# EAGLE design attinier84-motherboard-pth-mk-1.0 (EAGLE 6.5.0)
REVISION: 3.0
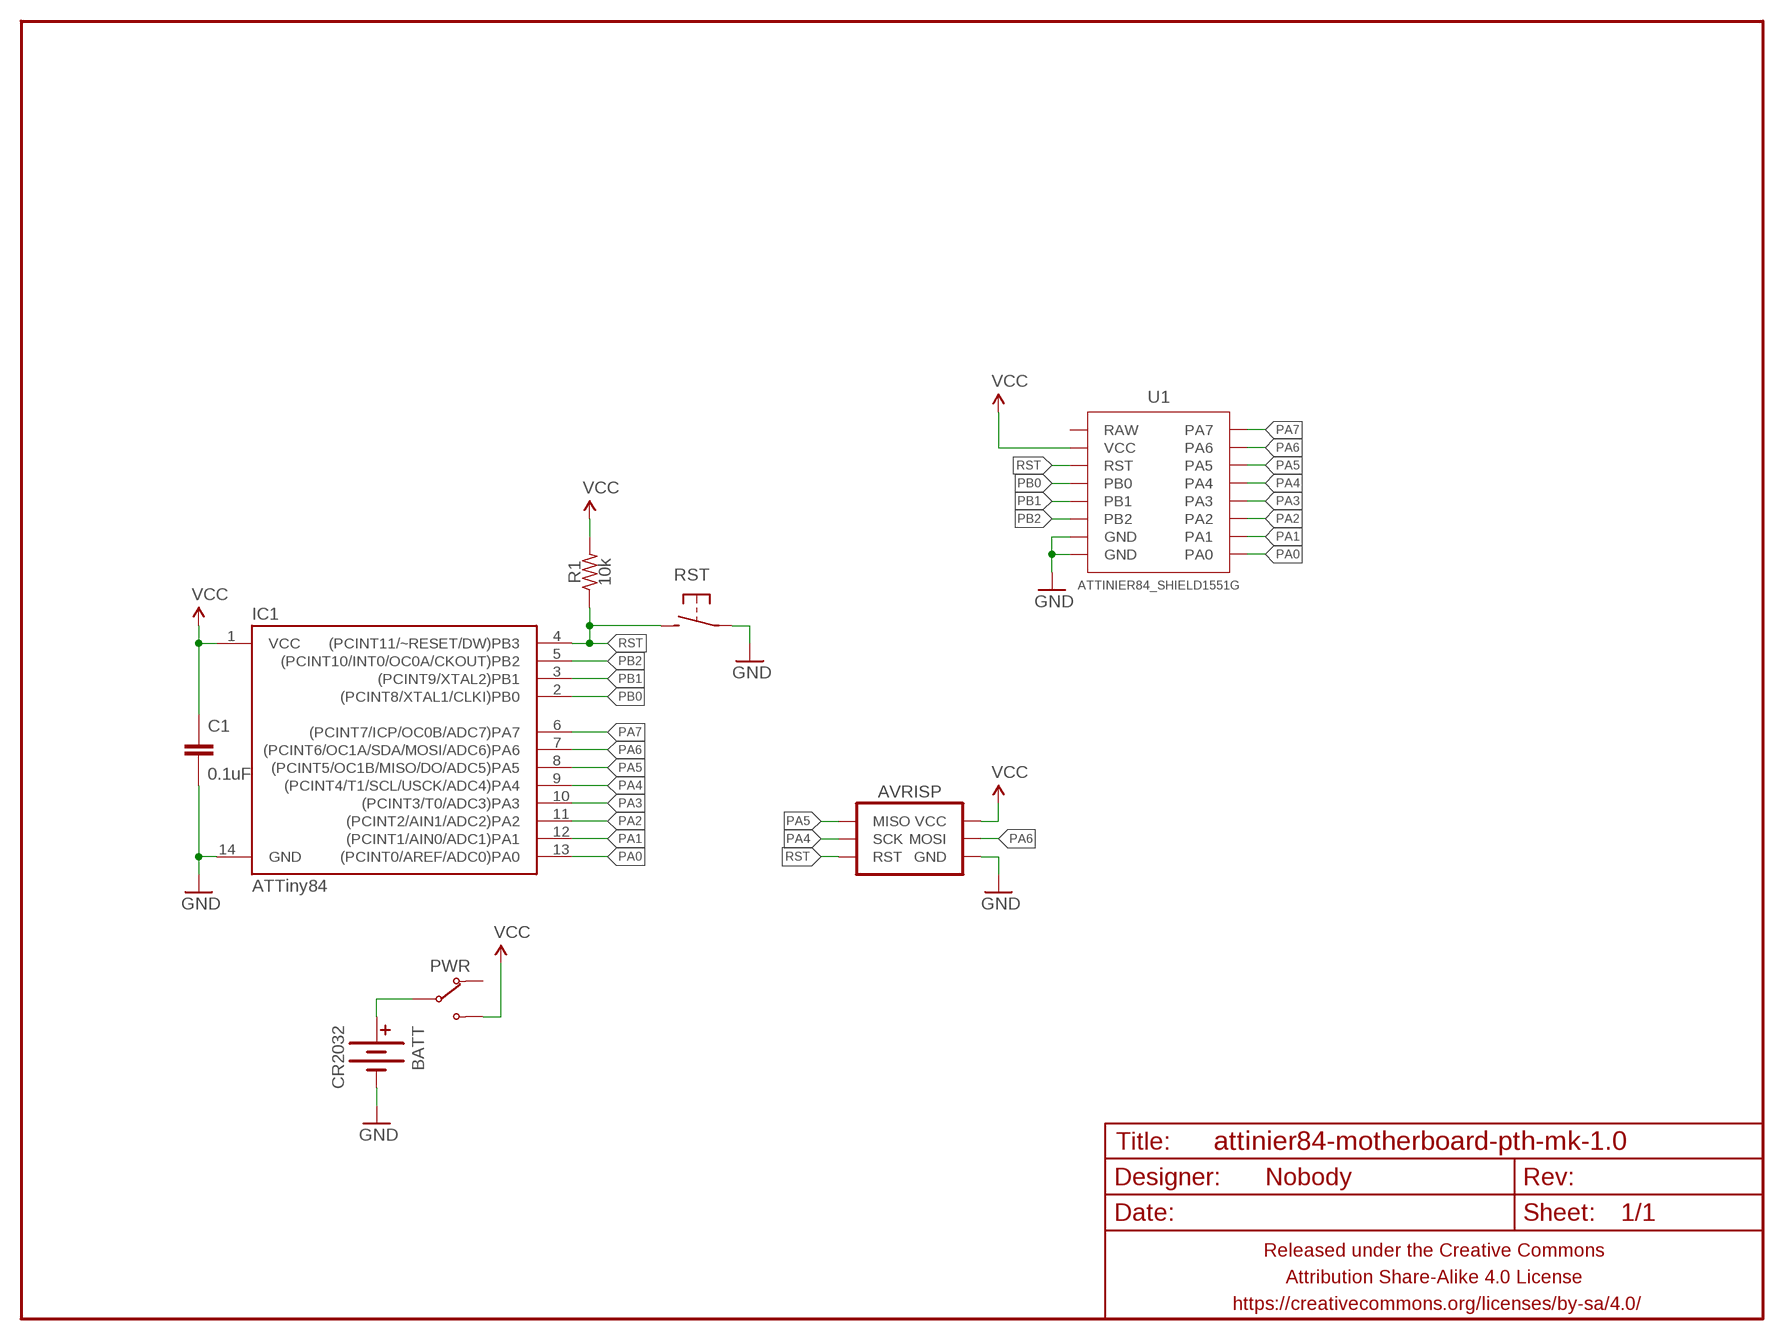
[diagram p0: schematic, sheet 1]

## Parts
AVRISP  AVR_SPI_PRG_6PTH  [2X3]
BATT  CR2032  BATTERY20PTH_TOPLOAD  [BATTCON_20MM_PTH_TOPLOAD]
C1  0.1uF  CAPACITOR-CERAMIC025-024X044  [C025-024X044]
FRAME1  FRAME-LETTERNO_PACKAGE  [DUMMY]
IC1  ATTiny84  ATTINY84ATTINY84-20PU  [DIL14]
PWR  SWITCH-SPDTPTH-RA-2.54MM  [SPDT-RA-2.54MM]
R1  10k  RESISTORPTH-AXIAL-7.62MM  [RESISTOR-AXIAL-PTH-7.62MM]
RST  SPST-NO-TACT3MM-RA  [TACTILE-PTH-SIDE]
U1  ATTINIER84_SHIELD1551G  [ATTINIER84_SHIELD2]

## Nets
GND: AVRISP.6(GND) BATT.- C1.2 IC1.14(GND) RST.1 U1.GND@1(GND) U1.GND@2(GND)
N$1: BATT.+ PWR.2(COM)
PA0: IC1.13((PCINT0/AREF/ADC0)PA0) U1.PA0
PA1: IC1.12((PCINT1/AIN0/ADC1)PA1) U1.PA1
PA2: IC1.11((PCINT2/AIN1/ADC2)PA2) U1.PA2
PA3: IC1.10((PCINT3/T0/ADC3)PA3) U1.PA3
PA4: AVRISP.3(SCK) IC1.9((PCINT4/T1/SCL/USCK/ADC4)PA4) U1.PA4
PA5: AVRISP.1(MISO) IC1.8((PCINT5/OC1B/MISO/DO/ADC5)PA5) U1.PA5
PA6: AVRISP.4(MOSI) IC1.7((PCINT6/OC1A/SDA/MOSI/ADC6)PA6) U1.PA6
PA7: IC1.6((PCINT7/ICP/OC0B/ADC7)PA7) U1.PA7
PB0: IC1.2((PCINT8/XTAL1/CLKI)PB0) U1.PB0
PB1: IC1.3((PCINT9/XTAL2)PB1) U1.PB1
PB2: IC1.5((PCINT10/INT0/OC0A/CKOUT)PB2) U1.PB2
RST: AVRISP.5(RST) IC1.4((PCINT11/~RESET/DW)PB3) R1.P$1 RST.2 U1.RST
VCC: AVRISP.2(VCC) C1.1 IC1.1(VCC) PWR.3(NO) R1.P$2 U1.VCC
Unconnected: PWR.1(NC) U1.RAW

## Library data of the parts
AVRISP = A_butts:AVR_SPI_PRG_6: AVR ISP 6 Pin This is the reduced ISP connector for AVR programming. Common on Arduino. This footprint will take up less PCB space and can be used with a 10-pin to 6-pin adapter such as SKU: BOB-08508 **Special note about "TEST_POINT" package. The stop mask is on the top side, so if you want your programming test points to be on the bottom of your board, make sure to place this package on the bottom side of the board. This also ensure that the orientation to program from the bottom side will be correct.
BATT = A_butts:BATTERY: Battery Holders Various common sizes : AA, AAA, 20mm coin cell and 12mm coin cell. 20MM_4LEGS, BATT-10373
C1 = A_butts:CAPACITOR-CERAMIC: CAPACITOR, European symbol
FRAME1 = A_butts:FRAME-LETTER: Schematic Frame Standard 8.5x11 US Letter frame; DESIGNER: Nobody
IC1 = A_butts:ATTINY84: Atmel 14-pin 2/4/8kB flash uC
PWR = A_butts:SWITCH-SPDT
R1 = A_butts:RESISTOR: RESISTOR, American symbol
RST = A_butts:SPST-NO-TACT
U1 = A_butts:ATTINIER84_SHIELD

## Board
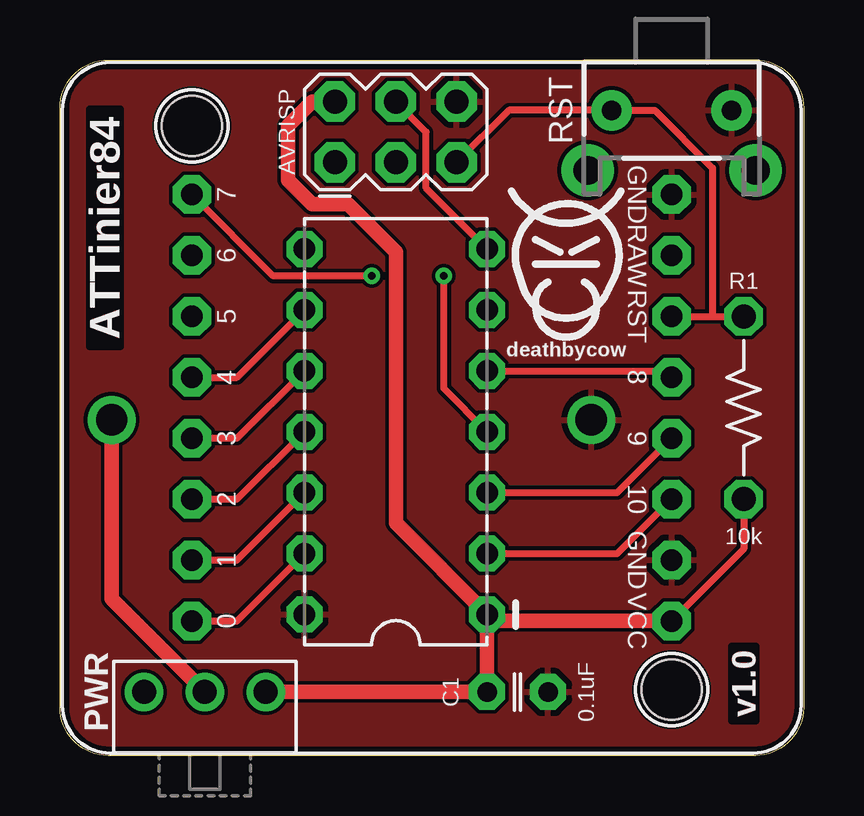
[diagram p1: board, top side]
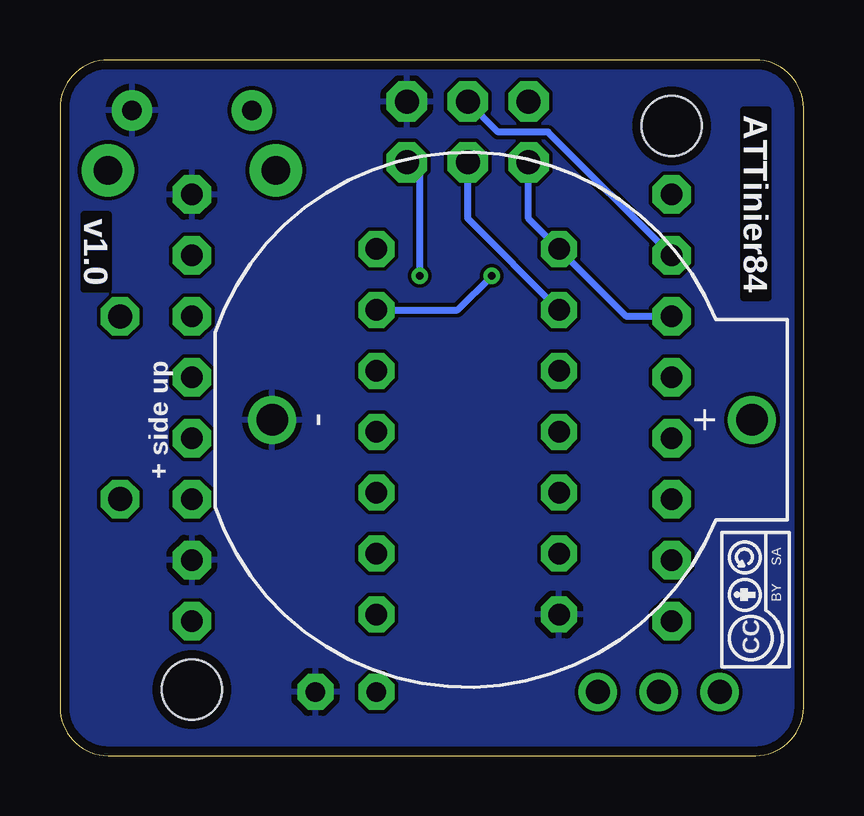
[diagram p2: board, bottom side, seen from below]

Size 31 x 29 mm. Coordinates in mm from the lower left corner, seen from the top.
Copper layers (1*16): Top 0.0356mm / dielectric 1.5011mm / Bottom 0.0356mm
Design rules "LaenPCBOrder_2": minimum track width 6mil, minimum drill 13mil, track to track 6mil, track to pad 6mil, pad to pad 6mil, via to via 6mil, smd to smd 6mil, copper to edge 15mil, drill to drill 6mil, minimum pad ring 7mil, minimum via ring 7mil, stop-mask expansion 3mil, vias tented up to drill 20mil, thermal gap 10mil

### Footprints (pad centres in the part's own frame; a part is rotated, then mirrored left to right if it is on the bottom)
2X3 = drill 1 pad 1.676 octagon: 1 -2.54,-1.27; 2 -2.54,1.27; 3 0,-1.27; 4 0,1.27; 5 2.54,-1.27; 6 2.54,1.27
BATTCON_20MM_PTH_TOPLOAD = drill 1.3 pad 2: + 11.85,0; - -8.15,0
C025-024X044 = drill 0.813 pad 1.5 octagon: 1 -1.27,0; 2 1.27,0
DIL14 = drill 0.9 pad 1.5 octagon: 1 -7.62,-3.81; 2 -5.08,-3.81; 3 -2.54,-3.81; 4 0,-3.81; 5 2.54,-3.81; 6 5.08,-3.81; 7 7.62,-3.81; 8 7.62,3.81; 9 5.08,3.81; 10 2.54,3.81; 11 0,3.81; 12 -2.54,3.81; 13 -5.08,3.81; 14 -7.62,3.81
SPDT-RA-2.54MM = drill 1 pad 1.6: 1 0,0; 2 2.54,0; 3 5.08,0
RESISTOR-AXIAL-PTH-7.62MM = drill 1 pad 1.6 octagon: P$1 -3.81,0; P$2 3.81,0
TACTILE-PTH-SIDE = drill 0.8 pad 1.7: 1 -2.5,0; 2 2.5,0 | drill 1.2 pad 2.2: ANCHOR1 -3.5,2.5; ANCHOR2 3.5,2.5
ATTINIER84_SHIELD2 = drill 0.9 pad 1.6 octagon: GND@1 10,-6.35; GND@2 10,8.89; PA0 -10,-8.89; PA1 -10,-6.35; PA2 -10,-3.81; PA3 -10,-1.27; PA4 -10,1.27; PA5 -10,3.81; PA6 -10,6.35; PA7 -10,8.89; PB0 10,-3.81; PB1 10,-1.27; PB2 10,1.27; RAW 10,6.35; RST 10,3.81; VCC 10,-8.89 | hole 2.5: -10,11.75; 10,-11.75

### Placement (x,y rotation side)
AVRISP  14,26 0 top
BATT  14,14 0 bottom
C1  19.08,2.65 0 top
FRAME1  0,0 0 top
IC1  14,13.5 90 top
PWR  3.5,2.65 0 top
R1  28.5,14.5 270 top
RST  25.5,26.9 180 top
U1  15.5,14.5 0 top
U$1  [CC-BY-SA-4.0-NO-URL]  2,6.5 90 bottom
U$2  [COW_SMALL]  21.1,21 0 top

### Tracks (layer width: path | path; a pad name or v marks a point on that pad's centre or on a via)
GND
  pour Bottom: -0.1,-0.1 -0.1,29.1 31.1,29.1 31.1,-0.1
  pour Top: -0.1,-0.1 -0.1,29.1 31.1,29.1 31.1,-0.1
N$1
  Top 0.6: BATT.+ 2.15,6.54 PWR.2
PA0
  Top 0.3: U1.PA0 7.38,5.61 IC1.13
PA1
  Top 0.3: U1.PA1 7.38,8.15 IC1.12
PA2
  Top 0.3: U1.PA2 7.38,10.69 IC1.11
PA3
  Top 0.3: U1.PA3 7.38,13.23 IC1.10
PA4
  Top 0.3: U1.PA4 7.38,15.77 IC1.9
  Bottom 0.3: IC1.9 14,22.39 AVRISP.3
PA5
  Bottom 0.3: AVRISP.1 11.46,22.39 IC1.8 7.38,18.31 U1.PA5
PA6
  Top 0.3: AVRISP.4 15.27,26 15.27,23.66 IC1.7
  Bottom 0.3: AVRISP.4 12.73,26 10.65,26 U1.PA6
PA7  (via drill 0.33)
  Top 0.3: v13,20 8.89,20 U1.PA7
  Bottom 0.3: IC1.6 14.42,18.58 v13,20
PB0
  Top 0.3: IC1.2 23.23,8.42 U1.PB0
PB1
  Top 0.3: IC1.3 23.23,10.96 U1.PB1
PB2
  Top 0.3: IC1.5 25.23,16.04 U1.PB2
RST  (via drill 0.33)
  Top 0.3: AVRISP.5 18.71,26.9 RST.2 24.8,26.9 27.2,24.5 27.2,18.31 | U1.RST 27.2,18.31 | 27.2,18.31 R1.P$1 | IC1.4 16,15.31 v16,20
  Bottom 0.3: v16,20 16,24.19 AVRISP.5
VCC
  Top 0.3: R1.P$2 28.5,8.61 U1.VCC
  Top 0.6: PWR.3 C1.1 IC1.1 | U1.VCC 18.08,5.61 IC1.1 | AVRISP.2 10.5,27.27 9.5,26.27 9.5,24 10.5,23 12,23 14,21 14,9.69 IC1.1

### Text on the board
Top: ATTinier84
Bottom: ATTinier84
tPlace: ATTinier84
bPlace: ATTinier84 | + side up